# Altium schematic sheet Main.SchDoc: Main
size A4; ApprovedBy: Ekrem Turan Fırat; CheckedBy: Ekrem Turan Fırat; Author: Ekrem Turan Fırat; CompanyName: Mergen Elektronik; DrawnBy: Ekrem T. Fırat; Engineer: Ekrem Turan Fırat; Organization: Mergen Elektronik; Address1: Türkiye; DocumentNumber: 20240101; Revision: v0.0.1; SheetNumber: 1; SheetTotal: 7
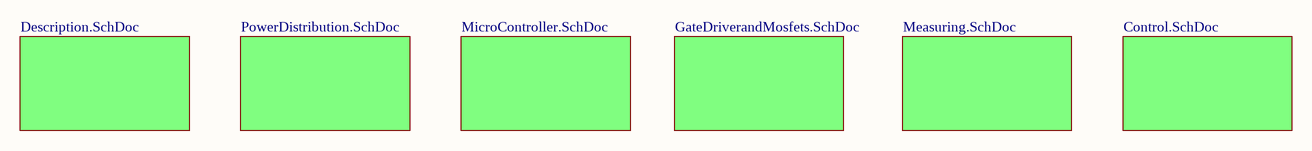
[diagram p0: Main.SchDoc]

## Sub-sheets
Designator = PowerDistribution.SchDoc: no entries
Designator = MicroController.SchDoc: no entries
Designator = GateDriverandMosfets.SchDoc: no entries
Designator = Measuring.SchDoc: no entries
Designator = Control.SchDoc: no entries
Designator = Description.SchDoc: no entries

## Notes on the sheet
- Title:
- Size:
- Date:
- A4
- Number:
- Time:
- Revision:
- Sheet
- of
- Project
- Drawn By :